# EAGLE design neopixel (EAGLE 9.5.2)
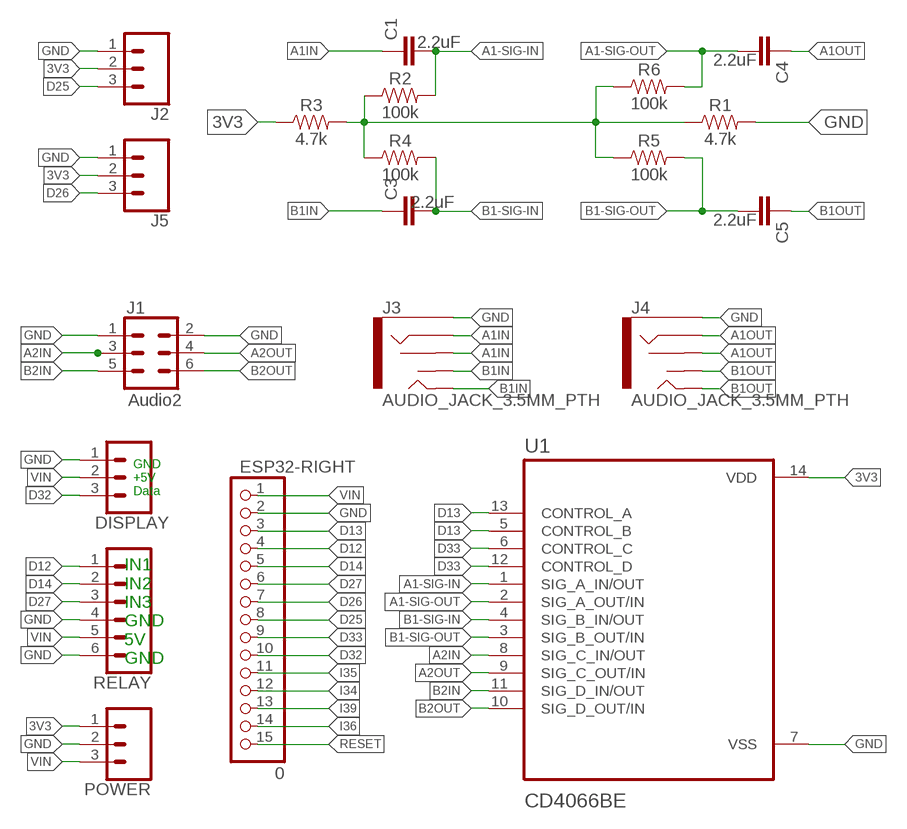
[diagram p0: schematic, sheet 1]

## Parts
C1  2.2uF  2.2UF-0805-25V-(+80/-20%)  [0805]
C3  2.2uF  2.2UF-0805-25V-(+80/-20%)  [0805]
C4  2.2uF  2.2UF-0805-25V-(+80/-20%)  [0805]
C5  2.2uF  2.2UF-0805-25V-(+80/-20%)  [0805]
DISPLAY  CONN_03  [1X03]
ESP32-RIGHT  0  PINHD-1X15  [1X15]
J1  Audio2  CONN_03X2FEMALE  [2X3]
J2  CONN_03  [1X03]
J3  AUDIO_JACK_3.5MM_PTH  [AUDIO-JACK]
J4  AUDIO_JACK_3.5MM_PTH  [AUDIO-JACK]
J5  CONN_03  [1X03]
POWER  CONN_03  [1X03]
R1  4.7k  0.3OHM-0805-1/8W-1%  [0805]
R2  100k  0.3OHM-0805-1/8W-1%  [0805]
R3  4.7k  0.3OHM-0805-1/8W-1%  [0805]
R4  100k  0.3OHM-0805-1/8W-1%  [0805]
R5  100k  0.3OHM-0805-1/8W-1%  [0805]
R6  100k  0.3OHM-0805-1/8W-1%  [0805]
RELAY  CONN_06NO_SILK_FEMALE_PTH  [1X06_NO_SILK]
U1  CD4066BE  [DIP794W45P254L1969H508Q14]

## Nets
3V3: J2.2 J5.2 POWER.1 R3.1 U1.14(VDD)
A1-SIG-IN: C1.2 R2.2 U1.1(SIG_A_IN/OUT)
A1-SIG-OUT: C4.2 R6.2 U1.2(SIG_A_OUT/IN)
A1IN: C1.1 J3.RING J3.RSH
A1OUT: C4.1 J4.RING J4.RSH
A2IN: J1.3 U1.8(SIG_C_IN/OUT)
A2OUT: J1.4 U1.9(SIG_C_OUT/IN)
B1-SIG-IN: C3.2 R4.2 U1.4(SIG_B_IN/OUT)
B1-SIG-OUT: C5.2 R5.2 U1.3(SIG_B_OUT/IN)
B1IN: C3.1 J3.TIP J3.TSH
B1OUT: C5.1 J4.TIP J4.TSH
B2IN: J1.5 U1.11(SIG_D_IN/OUT)
B2OUT: J1.6 U1.10(SIG_D_OUT/IN)
D12: ESP32-RIGHT.4 RELAY.1
D13: ESP32-RIGHT.3 U1.5(CONTROL_B) U1.13(CONTROL_A)
D14: ESP32-RIGHT.5 RELAY.2
D25: ESP32-RIGHT.8 J2.3
D26: ESP32-RIGHT.7 J5.3
D27: ESP32-RIGHT.6 RELAY.3
D32: DISPLAY.3 ESP32-RIGHT.10
D33: ESP32-RIGHT.9 U1.6(CONTROL_C) U1.12(CONTROL_D)
GND [POWER]: DISPLAY.1 ESP32-RIGHT.2 J1.1 J1.2 J2.1 J3.SLEEVE J4.SLEEVE J5.1 POWER.2 R1.2 RELAY.4 RELAY.6 U1.7(VSS)
I34: ESP32-RIGHT.12
I35: ESP32-RIGHT.11
I36: ESP32-RIGHT.14
I39: ESP32-RIGHT.13
N$2: R1.1 R2.1 R3.2 R4.1 R5.1 R6.1
RESET: ESP32-RIGHT.15
VIN [POWER]: DISPLAY.2 ESP32-RIGHT.1 POWER.3 RELAY.5

## Notes on the sheet
- GND
  +5V
  Data
- IN1
  IN2
  IN3
  GND
  5V
  GND

## Library data of the parts
C1 C3-C5 = SparkFun-Capacitors:2.2UF: 2.2µF ceramic capacitors A capacitor is a passive two-terminal electrical component used to store electrical energy temporarily in an electric field.; PROD_ID: CAP-11624
DISPLAY J2 J5 POWER = SparkFun-Connectors:CONN_03: Multi connection point. Often used as Generic Header-pin footprint for 0.1 inch spaced/style header connections On any of the 0.1 inch spaced packages, you can populate with these: Break Away Headers - Straight <https://www.sparkfun.com/products/116> (PRT-00116) Break Away Male Headers - Right Angle <https://www.sparkfun.com/products/553> (PRT-00553) Female Headers <https://www.sparkfun.com/products/115> (PRT-00115) Break Away Headers - Machine Pin <https://www.sparkfun.com/products/117> (PRT-00117) Break Away Female Headers - Swiss Machine Pin <https://www.sparkfun.com/products/743> (PRT-00743) Stackable Header - 3 Pin (Female, 0.1") <https://www.sparkfun.com/products/13875> (PRT-13875) For SCREWTERMINALS and SPRING TERMINALS visit here: Screw Terimnals on SparkFun.com <https://www.sparkfun.com/search/results?term=Screw+Terminals> (5mm/3.5mm/2.54mm spacing) This device is also useful as a general connection point to wire up your design to another part of your project. Our various solder wires solder well into these plated through hole pads. Hook-Up Wire - Assortment (Stranded, 22 AWG) <https://www.sparkfun.com/products/11375> (PRT-11375) Hook-Up Wire - Assortment (Solid Core, 22 AWG) <https://www.sparkfun.com/products/11367> (PRT-11367) View the entire wire category on our website here <https://www.sparkfun.com/categories/141> Special notes: Molex polarized connector foot print use with SKU : PRT-08232 with associated crimp pins and housings.
ESP32-RIGHT = pinhead:PINHD-1X15: PIN HEADER
J1 = SparkFun-Connectors:CONN_03X2: Multi connection point. Often used as Generic Header-pin footprint for 0.1 inch spaced/style header connections You can populate with any combo of single row headers, but if you'd like an exact match, check these: Header - 2x3 (Male, 0.1") <https://www.sparkfun.com/products/12807> (PRT-12807) Header - 2x3 (Female, 0.1") <https://www.sparkfun.com/products/13010> (PRT-13010) 2x3 Pin Shrouded Header <https://www.sparkfun.com/products/10877> (PRT-10877) On any of the 0.1 inch spaced packages, you can populate with these: Break Away Headers - Straight <https://www.sparkfun.com/products/116> (PRT-00116) Break Away Male Headers - Right Angle <https://www.sparkfun.com/products/553> (PRT-00553) Female Headers <https://www.sparkfun.com/products/115> (PRT-00115) Break Away Headers - Machine Pin <https://www.sparkfun.com/products/117> (PRT-00117) Break Away Female Headers - Swiss Machine Pin <https://www.sparkfun.com/products/743> (PRT-00743) Special note: the shrouded connector mates well with our 3x2 ribbon cables: Ribbon Crimp Connector - 6-pin (2x3, Female) <https://www.sparkfun.com/products/10651> (PRT-10651) Ribbon Cable - 6 wire (15ft) <https://www.sparkfun.com/products/10646> (PRT-10646); PROD_ID: CONN-11566; VALUE: FEMALE 2x3
J3 J4 = SparkFun-Connectors:AUDIO_JACK_3.5MM: Audio Jack 3.5mm variants of PTH and SMT stereo audio jack with bypass switches. SparkFun Products: SparkFun SparkPunk Sound Kit <[https://www.sparkfun.com/products/11177]> - PTH MP3 Trigger <https://www.sparkfun.com/products/13720> -3.5mm SMD SparkFun PicoBoard <https://www.sparkfun.com/products/11888>- 2.5mm SMD; PROD_ID: CONN-08774; SF_ID: PRT-08032
R1-R6 = SparkFun-Resistors:0.3OHM: 0.3Ω resistor A resistor is a passive two-terminal electrical component that implements electrical resistance as a circuit element. Resistors act to reduce current flow, and, at the same time, act to lower voltage levels within circuits. - Wikipedia; PROD_ID: RES-11622; VALUE: 0.3
RELAY = SparkFun-Connectors:CONN_06: Multi connection point. Often used as Generic Header-pin footprint for 0.1 inch spaced/style header connections On any of the 0.1 inch spaced packages, you can populate with these: Break Away Headers - Straight <https://www.sparkfun.com/products/116> (PRT-00116) Break Away Male Headers - Right Angle <https://www.sparkfun.com/products/553> (PRT-00553) Female Headers <https://www.sparkfun.com/products/115> (PRT-00115) Break Away Headers - Machine Pin <https://www.sparkfun.com/products/117> (PRT-00117) Break Away Female Headers - Swiss Machine Pin <https://www.sparkfun.com/products/743> (PRT-00743) Arduino Stackable Header - 6 Pin <https://www.sparkfun.com/products/9280> (PRT-09280) For SCREWTERMINALS and SPRING TERMINALS visit here: Screw Terimnals on SparkFun.com <https://www.sparkfun.com/search/results?term=Screw+Terminals> (5mm/3.5mm/2.54mm spacing) This device is also useful as a general connection point to wire up your design to another part of your project. Our various solder wires solder well into these plated through hole pads. Hook-Up Wire - Assortment (Stranded, 22 AWG) <https://www.sparkfun.com/products/11375> (PRT-11375) Hook-Up Wire - Assortment (Solid Core, 22 AWG) <https://www.sparkfun.com/products/11367> (PRT-11367) View the entire wire category on our website here <https://www.sparkfun.com/categories/141>; PROD_ID: CONN-08437
U1 = CD4066BE:CD4066BE: Check availability <https://pricing.snapeda.com/parts/CD4066BE/Texas%20Instruments/view-part?ref=eda>; AVAILABILITY: In Stock; DESCRIPTION: 10-pA on-state leakage current, 20-V, 1:1 (SPST), 4-channel analog switch; MF: Texas Instruments; MP: CD4066BE; PACKAGE: PDIP-14 Texas Instruments; PRICE: None; PURCHASE-URL: https://pricing.snapeda.com/search/part/CD4066BE/?ref=eda

## Net classes
1 POWER: width 0.3 mm

## Board
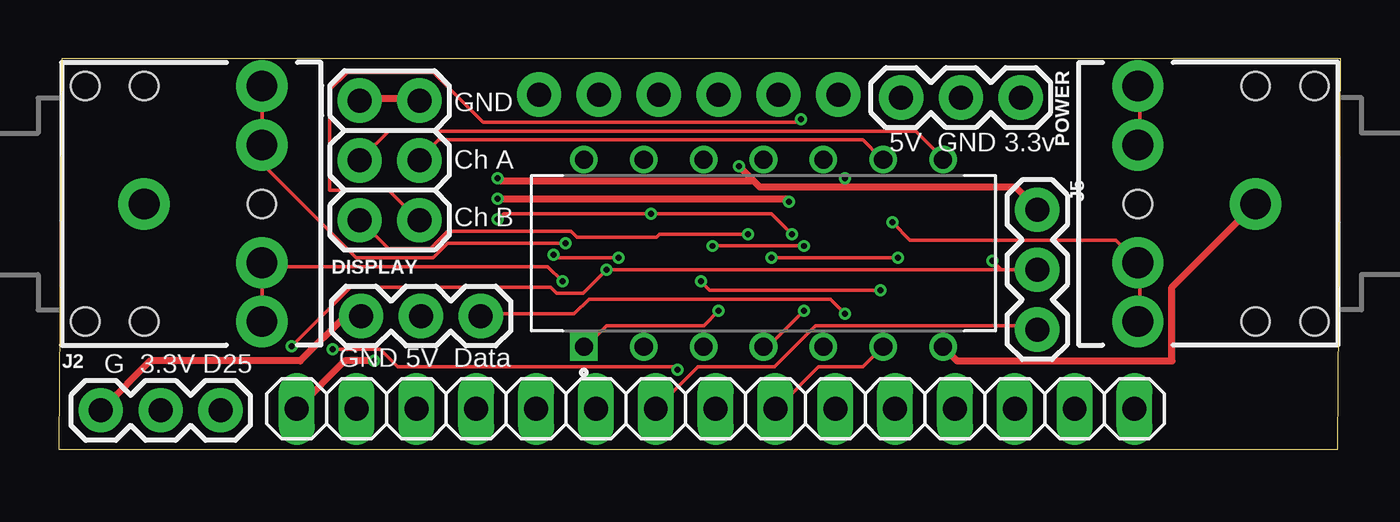
[diagram p1: board, top side]
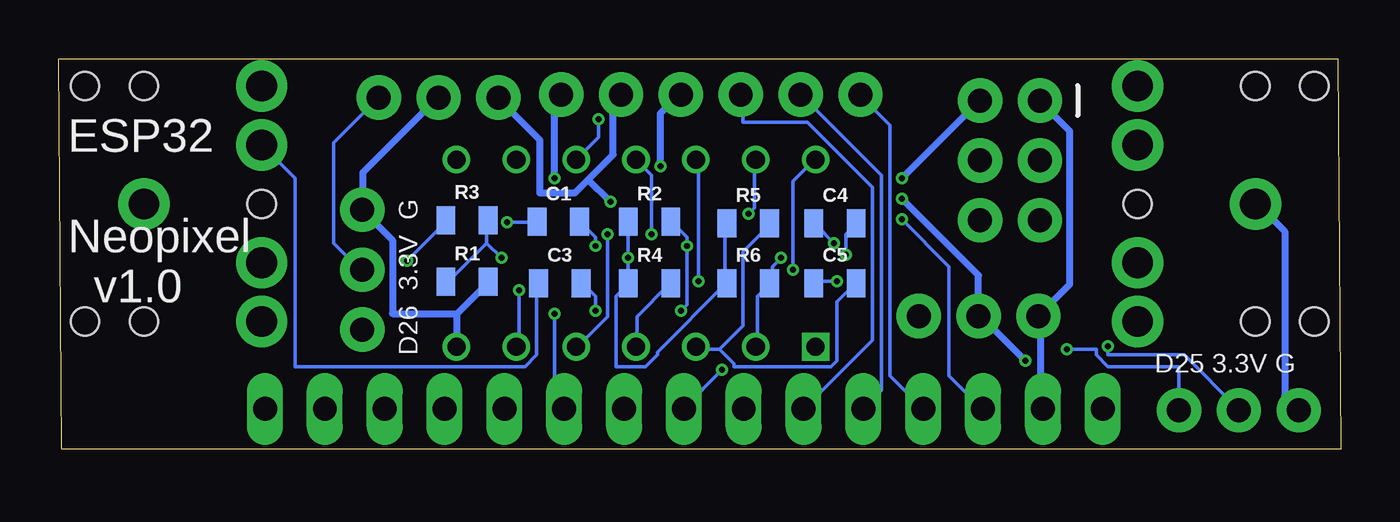
[diagram p2: board, bottom side, seen from below]

Size 54.41 x 16.56 mm. Coordinates in mm from the lower left corner, seen from the top.
Outline: 0,0 54.28,0 54.41,16.56 0.13,16.56 0,0
Copper layers (1*16): Top 0.035559375mm / dielectric 1.6mm / Bottom 0.035559375mm
Design rules "oshpark-2layer": minimum track width 6mil, minimum drill 10mil, track to track 6mil, track to pad 6mil, pad to pad 6mil, via to via 6mil, smd to smd 6mil, copper to edge 15mil, drill to drill 6mil, minimum pad ring 5mil, minimum via ring 5mil, stop-mask expansion 2.5mil, vias tented up to drill 0mil, thermal gap 10mil

### Footprints (pad centres in the part's own frame; a part is rotated, then mirrored left to right if it is on the bottom)
0805 = smd 0.8 x 1.2: 1 -0.9,0; 2 0.9,0
1X03 = drill 1.016 pad 1.88: 1 0,0; 2 2.54,0; 3 5.08,0
1X15 = drill 1.016 long: 1 -17.78,0; 2 -15.24,0; 3 -12.7,0; 4 -10.16,0; 5 -7.62,0; 6 -5.08,0; 7 -2.54,0; 8 0,0; 9 2.54,0; 10 5.08,0; 11 7.62,0; 12 10.16,0; 13 12.7,0; 14 15.24,0; 15 17.78,0
2X3 = drill 1.016 pad 1.88: 1 0,0; 2 0,2.54; 3 2.54,0; 4 2.54,2.54; 5 5.08,0; 6 5.08,2.54
AUDIO-JACK = drill 1.3 pad 2.184: RING 5,5; RSH 5,2.5; SLEEVE 0,0; TIP 5,-5; TSH 5,-2.5 | hole 1.2: 0,5; -2.5,5; -2.5,-5; 0,-5; 5,0
1X06_NO_SILK = drill 1.016 pad 1.88: 1 0,0; 2 2.54,0; 3 5.08,0; 4 7.62,0; 5 10.16,0; 6 12.7,0
DIP794W45P254L1969H508Q14 = drill 0.77 pad 1.17 square: 1 -3.97,7.62 | drill 0.77 pad 1.17: 2 -3.97,5.08; 3 -3.97,2.54; 4 -3.97,0; 5 -3.97,-2.54; 6 -3.97,-5.08; 7 -3.97,-7.62; 8 3.97,-7.62; 9 3.97,-5.08; 10 3.97,-2.54; 11 3.97,0; 12 3.97,2.54; 13 3.97,5.08; 14 3.97,7.62

### Placement (x,y rotation side)
C1  33.21,9.65 0 bottom
C3  33.15,7.05 0 bottom
C4  21.46,9.59 0 bottom
C5  21.46,7.05 0 bottom
DISPLAY  12.83,5.65 0 top
ESP32-RIGHT  27.88,1.71 0 top
J1  12.76,14.8 270 top
J2  1.78,1.65 0 top
J3  50.8,10.41 180 top
J4  3.62,10.41 0 top
J5  41.53,10.16 270 top
POWER  40.83,14.92 180 top
R1  37.08,7.11 0 bottom
R2  29.34,9.65 0 bottom
R3  37.08,9.72 0 bottom
R4  29.34,7.05 0 bottom
R5  25.15,9.59 0 bottom
R6  25.15,7.05 0 bottom
RELAY  20.38,15.05 0 top
U1  29.91,8.32 90 top

### Tracks (layer width: path | path; a pad name or v marks a point on that pad's centre or on a via)
3V3  (via drill 0.25)
  Top 0.152: 40,7.62 v39.62,8 | 40,7.62 41.5,7.62 J5.2 | 40,7.62 v23.25,7.62 22.25,6.62 21.12,6.62 20.88,6.88 12.38,6.88 v9.88,4.38
  Bottom 0.152: v39.62,8 38,9.62 R3.1 | v23.25,7.62 23.25,11.38 22.38,12.25 U1.14 | v9.88,4.38 9.88,4 6.62,4 4.38,1.75 J2.2 | POWER.1 40.88,14.88 42.75,13 42.75,8.75 41.62,7.62 J5.2
A1-SIG-IN  (via drill 0.25)
  Top 0.152: v28,5.88 27.38,5.25 23.25,5.25 22.38,4.38 U1.1 | v27.75,8.62 v31.62,8.62
  Bottom 0.152: v28,5.88 27.75,6.12 v27.75,8.62 27.75,9 28.38,9.62 R2.2 | v31.62,8.62 31.62,9 32.25,9.62 C1.2
A1-SIG-OUT  (via drill 0.25)
  Top 0.152: v21,8.25 21.12,8.12 v23.75,8.12
  Bottom 0.152: U1.2 24.75,4.38 24.75,6.5 24.25,7 R6.2 24.12,7.12 24.12,7.75 v23.75,8.12 | v21,8.25 21,9.12 20.62,9.5 C4.2
A1IN  (via drill 0.25)
  Top 0.152: v35.38,9.62 36.12,8.88 44.88,8.88 45.75,8 J3.RSH 45.88,7.88 45.88,5.5 J3.RING
  Bottom 0.152: v35.38,9.62 34.12,9.62 C1.1
A1OUT  (via drill 0.25)
  Top 0.152: v21.5,8.75 16.5,8.75 15.88,8.12 12.62,8.12 8.62,12.12 8.62,12.88 J4.RSH 8.62,13 8.62,15.38 J4.RING
  Bottom 0.152: v21.5,8.75 22.25,9.5 C4.1
A2IN
  Top 0.152: U1.8 37.5,12.38 36.38,13.5 14,13.5 12.88,12.38 J1.3
A2OUT
  Top 0.152: U1.9 34.88,12.38 34.12,13.12 16.12,13.12 15.38,12.38 J1.4
B1-SIG-IN  (via drill 0.25)
  Top 0.152: v31.62,5.88 30.12,4.38 30,4.38 U1.4
  Bottom 0.152: R4.2 28.5,7 29.88,5.62 29.88,4.38 U1.4 | v31.62,5.88 31.62,6.5 32.12,7 C3.2
B1-SIG-OUT
  Bottom 0.152: 26.38,4.25 25.75,3.62 25.75,3.5 21.62,3.5 21.38,3.75 21.38,6.25 20.62,7 C5.2 | 26.38,4.25 27.25,4.25 U1.3 | 26.38,4.25 25.38,5.25 25.38,8.38 24.25,9.5 R5.2
B1IN
  Top 0.152: J3.TIP 45.88,15.38 45.88,13 J3.TSH
  Bottom 0.152: C3.1 34.12,7 34.12,4 34.62,3.5 44.38,3.5 44.38,11.5 45.75,12.88 J3.TSH
B1OUT  (via drill 0.25)
  Top 0.152: v21.38,7.12 20.75,7.75 8.75,7.75 8.62,7.88 | 8.62,7.88 8.62,5.5 J4.TIP | 8.62,7.88 J4.TSH
  Bottom 0.152: v21.38,7.12 22.25,7.12 C5.1
B2IN  (via drill 0.25)
  Top 0.152: v29.25,9.12 25.5,9.12 25.38,9 22,9 21.75,9.25 16.5,9.25 15.75,8.5 14,8.5 12.88,9.62 J1.5
  Bottom 0.152: v29.25,9.12 29.25,11.62 29.88,12.25 U1.11
B2OUT  (via drill 0.25)
  Top 0.152: v31.5,14 31.38,13.88 18,13.88 15.88,16 12.25,16 11.5,15.25 11.5,11 14,11 15.25,9.75 J1.6
  Bottom 0.152: v31.5,14 31.5,13.25 32.38,12.38 U1.10
D12
  Bottom 0.152: ESP32-RIGHT.4 17.75,1.75 19.12,3.12 19.12,13.75 20.38,15 RELAY.1
D13  (via drill 0.25)
  Top 0.152: v31.12,9.12 30.25,10 v25.12,10 18.88,10 v18.62,9.75
  Bottom 0.152: v31.12,9.12 31.12,5.62 32.38,4.38 U1.5 | v25.12,10 24.88,10.25 24.88,12.25 U1.13 | v18.62,9.75 16.62,7.75 16.62,3.12 15.25,1.75 ESP32-RIGHT.3
D14
  Bottom 0.152: ESP32-RIGHT.5 20.25,1.75 19.5,2.5 19.5,11.62 22.88,15 RELAY.2
D25  (via drill 0.25)
  Top 0.152: v26.25,3.38 26.12,3.5 14.38,3.5 13.62,4.25 v11.62,4.25
  Bottom 0.152: v26.25,3.38 27.88,1.75 ESP32-RIGHT.8 | v11.62,4.25 10.38,4.25 10.38,4 9.88,3.5 6.88,3.5 6.88,1.75 J2.3
D26
  Top 0.152: ESP32-RIGHT.7 25.38,1.75 27.12,3.5 30.38,3.5 32.12,5.25 41.38,5.25 41.5,5.12 J5.3
D27
  Bottom 0.152: ESP32-RIGHT.6 22.75,1.75 19.88,4.62 19.88,11.12 22.62,13.88 25.38,13.88 25.38,15 RELAY.3
D32  (via drill 0.25)
  Top 0.152: v33.38,5.75 32.75,6.38 22.5,6.38 21.88,5.75 18,5.75 DISPLAY.3
  Bottom 0.152: v33.38,5.75 33.38,2.12 33,1.75 ESP32-RIGHT.10
D33  (via drill 0.25)
  Top 0.152: v27.25,7.12 27.62,6.75 v34.88,6.75 | ESP32-RIGHT.9 30.5,1.75 32.25,3.5 34.12,3.5 34.88,4.25 U1.6
  Bottom 0.152: v27.25,7.12 27.25,12.25 U1.12 | v34.88,6.75 34.88,4.38 U1.6
GND  (via drill 0.25)
  Top 0.3: J1.1 12.88,14.88 15.25,14.88 J1.2 | J2.1 1.88,1.75 3.88,3.75 10.25,3.75 12.12,5.62 12.75,5.62 DISPLAY.1 | 29.44,11.44 29.75,11.12 33.38,11.12 | 29.44,11.44 v28.88,12 | 33.38,11.12 40.62,11.12 41.5,10.25 J5.1 | 33.38,11.12 v33.38,11.5 | J3.SLEEVE 50.75,10.38 47.25,6.88 47.25,3.75 38.12,3.75 37.62,4.25 U1.7 | v18.62,11.5 18.75,11.38 29.38,11.38 29.44,11.44
  Bottom 0.3: J2.1 1.88,1.75 2.38,2.25 2.38,9.25 3.5,10.38 J4.SLEEVE | ESP32-RIGHT.2 12.75,1.75 12.75,5.62 DISPLAY.1 12.75,5.75 11.5,7 11.5,13.5 12.75,14.75 J1.1 | 37.5,5.75 36.25,7 R1.2 | 37.5,5.75 37.5,4.38 U1.7 | 37.5,5.75 40.25,5.75 40.25,8.88 41.5,10.12 J5.1 41.5,10.25 41.5,11.75 38.38,14.88 POWER.2 | v28.88,12 28.88,14.25 28.12,15 RELAY.4 | v33.38,11.5 33.38,14.75 33.12,15 RELAY.6 | v18.62,11.5 15.38,14.75 J1.2
N$2  (via drill 0.25)
  Top 0.152: v30.25,8.12 v35.62,8.12
  Bottom 0.152: 36.25,8.75 37.88,7.12 R1.1 | 36.25,8.75 36.25,9.62 R3.2 | R5.1 26.12,9.5 26.12,7.12 R6.1 26.12,7 29,4.12 29,4 29.5,3.5 30.75,3.5 30.75,6.5 30.25,7 R4.1 30.25,7.12 v30.25,8.12 30.25,9.62 R2.1 | v35.62,8.12 36.25,8.75
VIN  (via drill 0.25)
  Top 0.3: v13.38,3.75 12.12,3.75 10.12,1.75 ESP32-RIGHT.1 | v31,10.5 30.88,10.62 v18.62,10.62
  Bottom 0.3: 31.94,11.44 32.5,10.88 34,10.88 34,13.12 35.75,14.88 POWER.3 | 31.94,11.44 30.88,12.5 30.88,14.75 30.62,15 RELAY.5 | v13.38,3.75 15.25,5.62 DISPLAY.2 15.38,5.75 15.38,7.38 v18.62,10.62 | v31,10.5 31.94,11.44

### Text on the board
tPlace: 5V GND 3.3v | GND / / Ch A / / Ch B | G 3.3V D25 | GND 5V Data
bPlace: ESP32 / / Neopixel / v1.0 | D25 3.3V G | D26 3.3V G